# Altium schematic sheet Breakout.SchDoc: Breakouts
size Letter; SheetNumber: 5; SheetTotal: 12
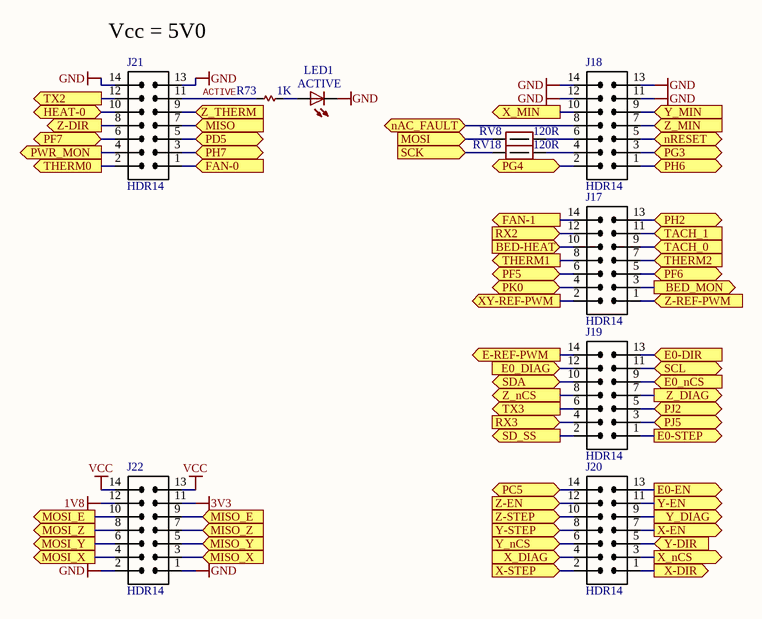
[diagram p0: Breakout.SchDoc]

## Parts
J17  HDR14  [HDR2x7_SMT_BOT_ENTRY_EX]
J18  HDR14  [HDR2x7_SMT_BOT_ENTRY_EX]
J19  HDR14  [HDR2x7_SMT_BOT_ENTRY_EX]
J20  HDR14  [HDR2x7_SMT_BOT_ENTRY_EX]
J21  HDR14  [HDR2x7_SMT_BOT_ENTRY_EX]
J22  HDR14  [HDR2x7_SMT_BOT_ENTRY_EX]
LED1  YEL  [LED2012120]  (value not drawn)
R73  1K  [R0402]
RV8  120R  [R0402]
RV18  120R  [R0402]

## Ports
BED-HEAT, BED_MON, E0-DIR, E0-EN, E0-STEP, E0_DIAG, E0_nCS, E-REF-PWM, FAN-0, FAN-1, HEAT-0, MISO, MISO_E, MISO_X, MISO_Y, MISO_Z, MOSI, MOSI_E, MOSI_X, MOSI_Y, MOSI_Z, nAC_FAULT, nRESET, PC5, PD5, PF5, PF6, PF7, PG3, PG4, PH2, PH6, PH7, PJ2, PJ5, PK0, PWR_MON, RX2, RX3, SCK, SCL, SD_SS, SDA, TACH_0, TACH_1, THERM0, THERM1, THERM2, TX2, TX3, X-DIR, X-EN, X-STEP, X_DIAG, X_MIN, X_nCS, XY-REF-PWM, Y-DIR, Y-EN, Y-STEP, Y_DIAG, Y_MIN, Y_nCS, Z-DIR, Z-EN, Z-REF-PWM, Z-STEP, Z_DIAG, Z_MIN, Z_nCS, Z_THERM

## Nets
1V8: J22.12(S)
3V3: J22.11(S)
GND: J18.11(S) J18.12(S) J18.13(S) J18.14(S) J21.13(S) J21.14(S) J22.1(S) J22.2(S) LED1.C
VCC: J22.13(S) J22.14(S)
ACTIVE: J21.11(S) R73.2
BED-HEAT: J17.10(S) ; port BED-HEAT
BED_MON: J17.3(S) ; port BED_MON
E0-DIR: J19.13(S) ; port E0-DIR
E0-EN: J20.13(S) ; port E0-EN
E0-STEP: J19.1(S) ; port E0-STEP
E0_DIAG: J19.12(S) ; port E0_DIAG
E0_nCS: J19.9(S) ; port E0_nCS
E-REF-PWM: J19.14(S) ; port E-REF-PWM
FAN-0: J21.1(S) ; port FAN-0
FAN-1: J17.14(S) ; port FAN-1
HEAT-0: J21.10(S) ; port HEAT-0
MISO: J21.7(S) ; port MISO
MISO_E: J22.9(S) ; port MISO_E
MISO_X: J22.3(S) ; port MISO_X
MISO_Y: J22.5(S) ; port MISO_Y
MISO_Z: J22.7(S) ; port MISO_Z
MOSI: RV8.2 ; port MOSI
MOSI_E: J22.10(S) ; port MOSI_E
MOSI_X: J22.4(S) ; port MOSI_X
MOSI_Y: J22.6(S) ; port MOSI_Y
MOSI_Z: J22.8(S) ; port MOSI_Z
nAC_FAULT: J18.8(S) ; port nAC_FAULT
nRESET: J18.5(S) ; port nRESET
PC5: J20.14(S) ; port PC5
PD5: J21.5(S) ; port PD5
PF5: J17.6(S) ; port PF5
PF6: J17.5(S) ; port PF6
PF7: J21.6(S) ; port PF7
PG3: J18.3(S) ; port PG3
PG4: J18.2(S) ; port PG4
PH2: J17.13(S) ; port PH2
PH6: J18.1(S) ; port PH6
PH7: J21.3(S) ; port PH7
PJ2: J19.5(S) ; port PJ2
PJ5: J19.3(S) ; port PJ5
PK0: J17.4(S) ; port PK0
PWR_MON: J21.4(S) ; port PWR_MON
RX2: J17.12(S) ; port RX2
RX3: J19.4(S) ; port RX3
SCK: RV18.2 ; port SCK
SCL: J19.11(S) ; port SCL
SD_SS: J19.2(S) ; port SD_SS
SDA: J19.10(S) ; port SDA
TACH_0: J17.9(S) ; port TACH_0
TACH_1: J17.11(S) ; port TACH_1
THERM0: J21.2(S) ; port THERM0
THERM1: J17.8(S) ; port THERM1
THERM2: J17.7(S) ; port THERM2
TX2: J21.12(S) ; port TX2
TX3: J19.6(S) ; port TX3
X-DIR: J20.1(S) ; port X-DIR
X-EN: J20.7(S) ; port X-EN
X-STEP: J20.2(S) ; port X-STEP
X_DIAG: J20.4(S) ; port X_DIAG
X_MIN: J18.10(S) ; port X_MIN
X_nCS: J20.3(S) ; port X_nCS
XY-REF-PWM: J17.2(S) ; port XY-REF-PWM
Y-DIR: J20.5(S) ; port Y-DIR
Y-EN: J20.11(S) ; port Y-EN
Y-STEP: J20.8(S) ; port Y-STEP
Y_DIAG: J20.9(S) ; port Y_DIAG
Y_MIN: J18.9(S) ; port Y_MIN
Y_nCS: J20.6(S) ; port Y_nCS
Z-DIR: J21.8(S) ; port Z-DIR
Z-EN: J20.12(S) ; port Z-EN
Z-REF-PWM: J17.1(S) ; port Z-REF-PWM
Z-STEP: J20.10(S) ; port Z-STEP
Z_DIAG: J19.7(S) ; port Z_DIAG
Z_MIN: J18.7(S) ; port Z_MIN
Z_nCS: J19.8(S) ; port Z_nCS
Z_THERM: J21.9(S) ; port Z_THERM
NetJ18_4: J18.4(S) RV18.1
NetJ18_6: J18.6(S) RV8.1
NetLED1_A: LED1.A R73.1

## Notes on the sheet
- (near J21) Vcc = 5V0
- (near LED1) ACTIVE
- Title:
- Project:
- File:
- Ver:
- Drawn by:
- Sheet:
- of

## Library data of the parts
J17-J22 = CONN 14PIN 0.1" FEMALE 2-ROW SMT BOT-ENTRY_EX: CONN RCPT DUAL ENTRY 14POS .100"; MANUFACTURER: TE Connectivity; MANUFACTURER #: 969973-7; PART DESCRIPTION: 14 Position Receptacle, Bottom or Top Entry Connector Gold 0.100" (2.54mm) Surface Mount; TOLERANCE: -NA-; DISTRIBUTOR #: A107060CT-ND; DISTRIBUTOR: Digikey; PART: HDR14; EE_SPEC: -NA-; VALUE: HDR14
LED1 = 5988140107F: LED 0805 Yellow; Manufacturer: Dialight; Part Description: Yellow 593nm LED Indication - Discrete 2V 0805 (2012 Metric); EE_SPEC: 2V 0.02A; Tolerance: NA; VALUE: YEL; DISTRIBUTOR #: 350-2041-2-ND; DISTRIBUTOR: Digi-Key; MANUFACTURER #: 5988140107F; PART: YEL
R73 = RC0402FR-071KL: RES SMD 1K OHM 1% 1/16W 0402; Manufacturer: Yageo; Part Description: 1k Ohm ±1% 0.063W, 1/16W Chip Resistor 0402 (1005 Metric) Moisture Resistant Thick Film; EE_SPEC: 1k 1% 0402; Tolerance: +/- 1%; VALUE: 1K; MANUFACTURER #: RC0402FR-071KL; DISTRIBUTOR #: 311-1.00KLRTR-ND; DISTRIBUTOR: Digi-Key; PART: 1k
RV8 RV18 = FERRITE 120R 1A 0402: FERRITE BEAD 120 OHM 0402 1LN; MANUFACTURER: Taiyo Yuden; MANUFACTURER #: BKP1005HS121-T; VALUE: 120Rfb; TOLERANCE: -NA-; EE_SPEC: 1A; DISTRIBUTOR #: 587-1921-2-ND; DISTRIBUTOR: Digikey; PART: FERRITE 120R 1A 0402; PART DESCRIPTION: FERRITE BEAD 120 OHM 0402 1LN